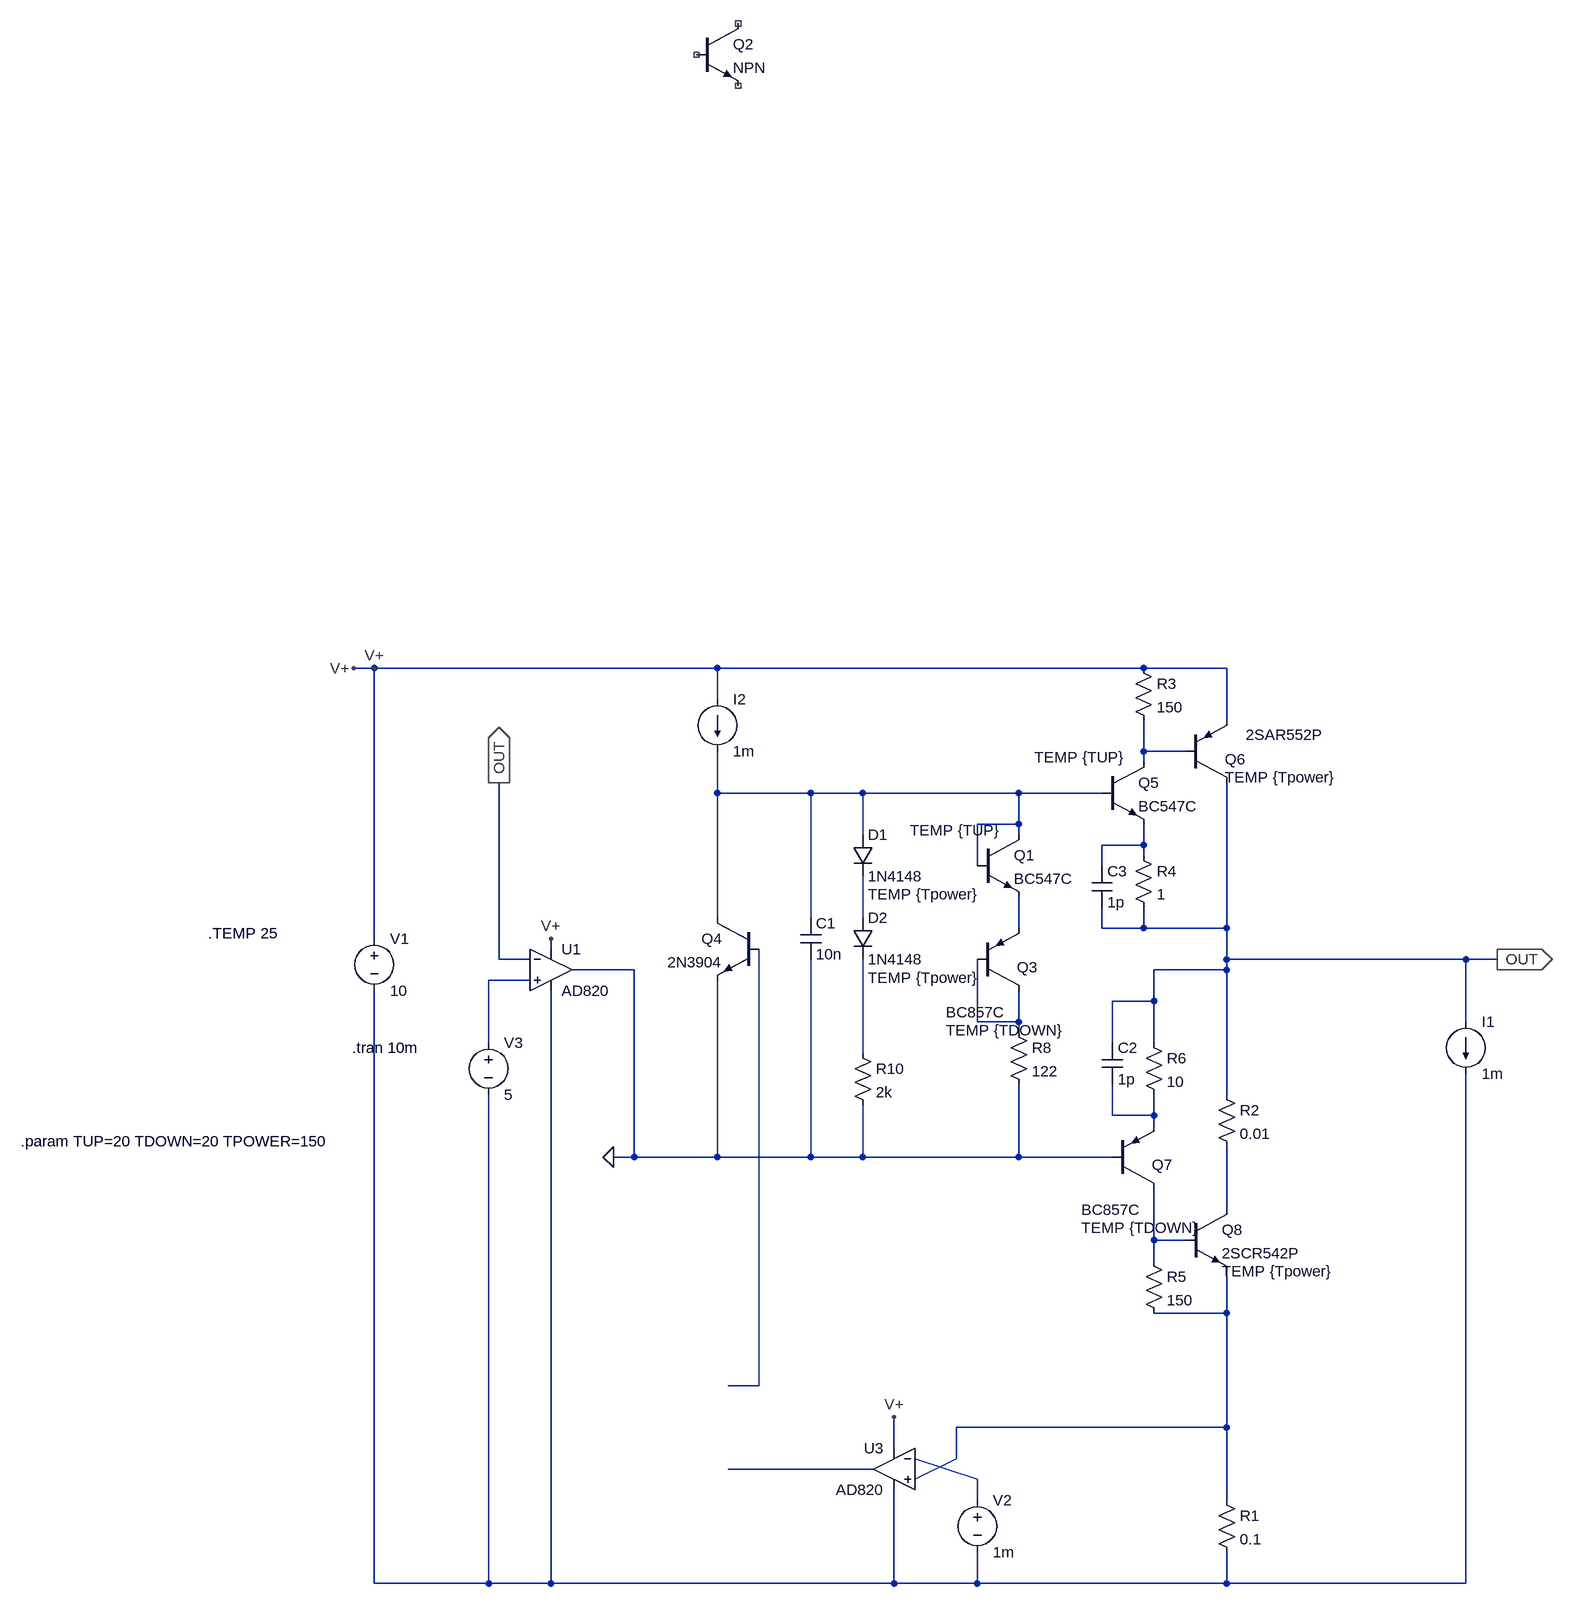
[diagram p0: schematic super_fast_push_pull_bias_voltage.asc]
super_fast_push_pull_bias_voltage.asc, the LTspice schematic file:
Version 4
SHEET 1 3148 1828
WIRE 16 144 -16 144
WIRE 544 144 16 144
WIRE 1200 144 544 144
WIRE 1328 144 1200 144
WIRE 544 192 544 144
WIRE 1328 224 1328 144
WIRE 1200 272 1200 224
WIRE 1264 272 1200 272
WIRE 1200 288 1200 272
WIRE 544 336 544 272
WIRE 688 336 544 336
WIRE 768 336 688 336
WIRE 1008 336 768 336
WIRE 1136 336 1008 336
WIRE 1008 384 1008 336
WIRE 1008 384 944 384
WIRE 768 400 768 336
WIRE 1008 400 1008 384
WIRE 1200 416 1200 384
WIRE 1200 416 1136 416
WIRE 1200 432 1200 416
WIRE 944 448 944 384
WIRE 1136 448 1136 416
WIRE 544 528 544 336
WIRE 688 528 688 336
WIRE 768 528 768 464
WIRE 1008 544 1008 496
WIRE 1136 544 1136 512
WIRE 1200 544 1200 512
WIRE 1200 544 1136 544
WIRE 1328 544 1328 320
WIRE 1328 544 1200 544
WIRE 16 560 16 144
WIRE 288 576 288 560
WIRE 208 592 208 320
WIRE 256 592 208 592
WIRE 1328 592 1328 544
WIRE 1696 592 1328 592
WIRE 1744 592 1696 592
WIRE 416 608 320 608
WIRE 1328 608 1328 592
WIRE 1328 608 1216 608
WIRE 256 624 192 624
WIRE 1216 656 1216 608
WIRE 1216 656 1152 656
WIRE 944 688 944 592
WIRE 1008 688 1008 640
WIRE 1008 688 944 688
WIRE 1696 688 1696 592
WIRE 1008 704 1008 688
WIRE 192 720 192 624
WIRE 1152 720 1152 656
WIRE 1216 720 1216 656
WIRE 768 736 768 592
WIRE 1328 800 1328 608
WIRE 1152 832 1152 784
WIRE 1216 832 1216 800
WIRE 1216 832 1152 832
WIRE 1216 848 1216 832
WIRE 416 896 416 608
WIRE 416 896 384 896
WIRE 544 896 544 624
WIRE 544 896 416 896
WIRE 688 896 688 592
WIRE 688 896 544 896
WIRE 768 896 768 816
WIRE 768 896 688 896
WIRE 1008 896 1008 784
WIRE 1008 896 768 896
WIRE 1152 896 1008 896
WIRE 1328 976 1328 880
WIRE 1216 1024 1216 944
WIRE 1264 1024 1216 1024
WIRE 1216 1056 1216 1024
WIRE 1328 1136 1328 1072
WIRE 1328 1136 1216 1136
WIRE 608 1248 608 576
WIRE 608 1248 560 1248
WIRE 1328 1312 1328 1136
WIRE 1328 1312 912 1312
WIRE 816 1344 816 1296
WIRE 912 1360 912 1312
WIRE 784 1376 560 1376
WIRE 848 1392 912 1360
WIRE 944 1392 848 1360
WIRE 944 1424 944 1392
WIRE 1328 1424 1328 1312
WIRE 16 1552 16 640
WIRE 192 1552 192 800
WIRE 192 1552 16 1552
WIRE 288 1552 288 640
WIRE 288 1552 192 1552
WIRE 816 1552 816 1408
WIRE 816 1552 288 1552
WIRE 944 1552 944 1504
WIRE 944 1552 816 1552
WIRE 1328 1552 1328 1504
WIRE 1328 1552 944 1552
WIRE 1696 1552 1696 768
WIRE 1696 1552 1328 1552
FLAG 16 144 V+
FLAG 816 1296 V+
FLAG -16 144 V+
FLAG 288 560 V+
FLAG 384 896 0
FLAG 1744 592 OUT
IOPIN 1744 592 Out
FLAG 208 320 OUT
IOPIN 208 320 Out
SYMBOL voltage 16 544 R0
WINDOW 123 0 0 Left 0
WINDOW 39 0 0 Left 0
SYMATTR InstName V1
SYMATTR Value 10
SYMBOL npn 512 -848 R0
SYMATTR InstName Q2
SYMBOL res 1312 1408 R0
SYMATTR InstName R1
SYMATTR Value 0.1
SYMBOL cap 672 528 R0
SYMATTR InstName C1
SYMATTR Value 10n
SYMBOL voltage 944 1408 R0
WINDOW 123 0 0 Left 0
WINDOW 39 0 0 Left 0
SYMATTR InstName V2
SYMATTR Value 1m
SYMBOL current 544 192 R0
WINDOW 123 0 0 Left 0
WINDOW 39 0 0 Left 0
SYMATTR InstName I2
SYMATTR Value 1m
SYMBOL OpAmps\\AD820 816 1312 M0
SYMATTR InstName U3
SYMBOL OpAmps\\AD820 288 544 R0
SYMATTR InstName U1
SYMBOL voltage 192 704 R0
WINDOW 123 0 0 Left 0
WINDOW 39 0 0 Left 0
SYMATTR InstName V3
SYMATTR Value 5
SYMBOL npn 608 528 M0
SYMATTR InstName Q4
SYMATTR Value 2N3904
SYMBOL current 1696 688 R0
WINDOW 123 0 0 Left 0
WINDOW 39 0 0 Left 0
SYMATTR InstName I1
SYMATTR Value 1m
SYMBOL npn 1136 288 R0
WINDOW 39 -104 -7 Left 2
SYMATTR SpiceLine TEMP {TUP}
SYMATTR InstName Q5
SYMATTR Value BC547C
SYMBOL pnp 1264 320 M180
WINDOW 0 61 36 Left 2
WINDOW 3 93 74 Left 2
WINDOW 39 61 8 Left 2
SYMATTR InstName Q6
SYMATTR Value 2SAR552P
SYMATTR SpiceLine TEMP {Tpower}
SYMBOL res 1184 128 R0
SYMATTR InstName R3
SYMATTR Value 150
SYMBOL res 1184 416 R0
SYMATTR InstName R4
SYMATTR Value 1
SYMBOL pnp 1152 944 M180
WINDOW 0 61 36 Left 2
WINDOW 3 -48 -33 Left 2
WINDOW 39 -48 -61 Left 2
SYMATTR InstName Q7
SYMATTR Value BC857C
SYMATTR SpiceLine TEMP {TDOWN}
SYMBOL npn 1264 976 R0
WINDOW 39 56 96 Left 2
SYMATTR SpiceLine TEMP {Tpower}
SYMATTR InstName Q8
SYMATTR Value 2SCR542P
SYMBOL res 1200 1040 R0
SYMATTR InstName R5
SYMATTR Value 150
SYMBOL res 1200 704 R0
SYMATTR InstName R6
SYMATTR Value 10
SYMBOL cap 1136 720 R0
SYMATTR InstName C2
SYMATTR Value 1p
SYMATTR SpiceLine Rser=1
SYMBOL cap 1120 448 R0
SYMATTR InstName C3
SYMATTR Value 1p
SYMATTR SpiceLine Rser=1
SYMBOL res 1312 784 R0
SYMATTR InstName R2
SYMATTR Value 0.01
SYMBOL npn 944 400 R0
WINDOW 39 -104 -7 Left 2
SYMATTR SpiceLine TEMP {TUP}
SYMATTR InstName Q1
SYMATTR Value BC547C
SYMBOL pnp 944 640 M180
WINDOW 0 61 36 Left 2
WINDOW 3 -48 -33 Left 2
WINDOW 39 -48 -61 Left 2
SYMATTR InstName Q3
SYMATTR Value BC857C
SYMATTR SpiceLine TEMP {TDOWN}
SYMBOL res 992 688 R0
SYMATTR InstName R8
SYMATTR Value 122
SYMBOL diode 752 400 R0
WINDOW 39 24 92 Left 2
SYMATTR InstName D1
SYMATTR Value 1N4148
SYMATTR SpiceLine TEMP {Tpower}
SYMBOL diode 752 528 R0
WINDOW 39 24 92 Left 2
SYMATTR InstName D2
SYMATTR Value 1N4148
SYMATTR SpiceLine TEMP {Tpower}
SYMBOL res 752 720 R0
SYMATTR InstName R10
SYMATTR Value 2k
TEXT -18 728 Left 2 !.tran 10m
TEXT -240 552 Left 2 !.TEMP 25
TEXT -528 872 Left 2 !.param TUP=20 TDOWN=20 TPOWER=150

The netlist it stands for:
* super_fast_push_pull_bias_voltage.asc
V1 V+ N016 10
Q2 NC_01 NC_02 NC_03 0 NPN
R1 N012 N016 0.1
C1 N002 0 10n
V2 N015 N016 1m
I2 V+ N002 1m
XU3 N012 N015 V+ N016 N014 AD820  ; pins In+ In- V+ V- OUT
XU1 N006 OUT V+ N016 0 AD820  ; pins In+ In- V+ V- OUT
V3 N006 N016 5
Q4 N002 N013 0 0 2N3904
I1 OUT N016 1m
Q5 N001 N002 N003 0 BC547C TEMP {TUP}
Q6 OUT N001 V+ 0 2SAR552P TEMP {Tpower}
R3 V+ N001 150
R4 N003 OUT 1
Q7 N011 0 N009 0 BC857C TEMP {TDOWN}
Q8 N010 N011 N012 0 2SCR542P TEMP {Tpower}
R5 N011 N012 150
R6 OUT N009 10
C2 OUT N009 1p Rser=1
C3 N003 OUT 1p Rser=1
R2 OUT N010 0.01
Q1 N002 N002 N005 0 BC547C TEMP {TUP}
Q3 N007 N007 N005 0 BC857C TEMP {TDOWN}
R8 N007 0 122
D1 N002 N004 1N4148 TEMP {Tpower}
D2 N004 N008 1N4148 TEMP {Tpower}
R10 N008 0 2k
.model D D
.lib standard.dio
.model NPN NPN
.model PNP PNP
.lib standard.bjt
.tran 10m
.TEMP 25
.param TUP=20 TDOWN=20 TPOWER=150
.backanno
.end